# Altium project Catan_Dice_Tile.PrjPcb
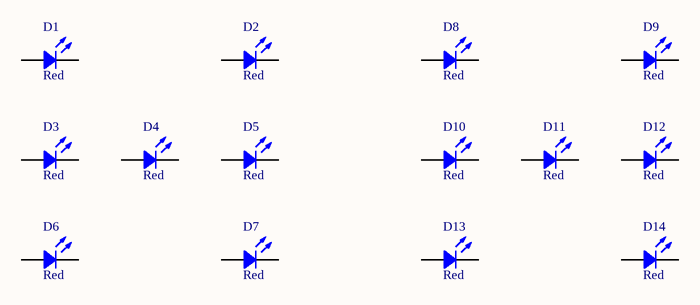
[diagram p0: Top.SchDoc]
DrawnBy: Shivam Sharma; Project: ESC; Revision: 1.0
1 sheet, 14 parts. Net scope: strictly hierarchical (ports join the sheet entries above them; power ports are local).
Board file: Catan_Dice_Tile.PcbDoc

## Sheet Top.SchDoc
size B; SheetNumber: 1; SheetTotal: 1

### Parts
D1  Red  [LED 0402_1005 RED]
D2  Red  [LED 0402_1005 RED]
D3  Red  [LED 0402_1005 RED]
D4  Red  [LED 0402_1005 RED]
D5  Red  [LED 0402_1005 RED]
D6  Red  [LED 0402_1005 RED]
D7  Red  [LED 0402_1005 RED]
D8  Red  [LED 0402_1005 RED]
D9  Red  [LED 0402_1005 RED]
D10  Red  [LED 0402_1005 RED]
D11  Red  [LED 0402_1005 RED]
D12  Red  [LED 0402_1005 RED]
D13  Red  [LED 0402_1005 RED]
D14  Red  [LED 0402_1005 RED]

### Nets

Not connected (* = marked no-connect by the designer): D1 1 2; D2 1 2; D3 1 2; D4 1 2; D5 1 2; D6 1 2; D7 1 2; D8 1 2; D9 1 2; D10 1 2; D11 1 2; D12 1 2; D13 1 2; D14 1 2

### Library data of the parts
D1-D14 = EAST10052RA1: LED RED CLEAR 2SMD; Manufacturer: Everlight Electronics Co Ltd; Configuration: Standard; Current - Test: 5mA; Lens Color: Colorless; Lens Size: 1.00mm x 0.50mm; Lens Style: Rectangle with Flat Top; Viewing Angle: 120°; Voltage - Forward (Vf) (Typ): 2.05V; Wavelength - Peak: 632nm; Part Number: EAST10052RA1; Color: Red; ComponentLink1Description: Datasheet; ComponentLink1URL: https://everlightamericas.com/index.php?controller=attachment&id_attachment=2715; ComponentLink2Description: DigiKey Link; ComponentLink2URL: https://www.digikey.com/en/products/detail/everlight-electronics-co-ltd/EAST10052RA1/8510368; Device Package: 0402 (1005 Metric); Height (Max): 0.25mm; LastUpdated: 3/11/2024 7:51:34 AM; Lens Transparency: Clear; Lifecycle Status: Active; Minimum Order: 1; Mounting Type: Surface Mount; Package / Case: 0402 (1005 Metric); Packaging: TapeAndReel; PartId: 502; Part Status: Active; Price: 0.07; Series: -; Size / Dimension: 1.00mm L x 0.50mm W; Supplier 1: DigiKey; Supplier Part Number 1: 1080-1559-1-ND; Supplier Device Package: 2-SMD; Value: Red

## Assembly variants
Main: all parts fitted